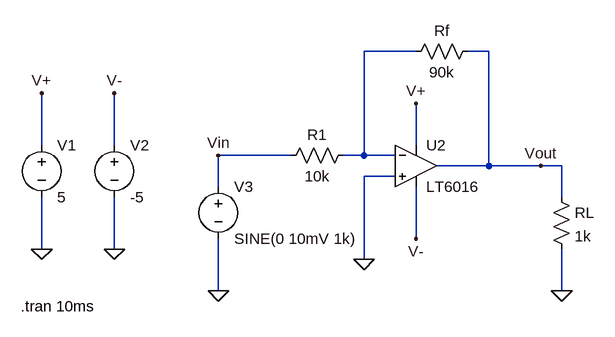
[diagram p0: schematic Lab_Task_3.asc]
Lab_Task_3.asc, the LTspice schematic file:
Version 4.1
SHEET 1 880 680
WIRE 240 0 160 0
WIRE 352 0 320 0
WIRE -336 144 -336 64
WIRE -224 144 -224 64
WIRE 240 144 240 80
WIRE 48 160 -64 160
WIRE 160 160 160 0
WIRE 160 160 128 160
WIRE 208 160 160 160
WIRE 352 176 352 0
WIRE 352 176 272 176
WIRE 432 176 352 176
WIRE 464 176 432 176
WIRE 208 192 160 192
WIRE -64 208 -64 160
WIRE 464 224 464 176
WIRE 240 288 240 208
WIRE -336 304 -336 224
WIRE -224 304 -224 224
WIRE 160 320 160 192
WIRE -64 368 -64 288
WIRE 464 368 464 304
FLAG 464 368 0
FLAG -64 368 0
FLAG -336 304 0
FLAG -224 304 0
FLAG 432 176 Vout
FLAG 160 320 0
FLAG -64 160 Vin
FLAG 240 80 V+
FLAG -336 64 V+
FLAG -224 64 V-
FLAG 240 288 V-
SYMBOL OpAmps\\LT6016 240 176 R0
SYMATTR InstName U2
SYMBOL res 448 208 R0
SYMATTR InstName RL
SYMATTR Value 1k
SYMBOL res 144 144 R90
WINDOW 0 0 56 VBottom 2
WINDOW 3 32 56 VTop 2
SYMATTR InstName R1
SYMATTR Value 10k
SYMBOL voltage -64 192 R0
SYMATTR InstName V3
SYMATTR Value SINE(0 10mV 1k)
SYMBOL res 336 -16 R90
WINDOW 0 0 56 VBottom 2
WINDOW 3 32 56 VTop 2
SYMATTR InstName Rf
SYMATTR Value 90k
SYMBOL voltage -336 128 R0
SYMATTR InstName V1
SYMATTR Value 5
SYMBOL voltage -224 128 R0
SYMATTR InstName V2
SYMATTR Value -5
TEXT -368 392 Left 2 !.tran 10ms

The netlist it stands for:
* Lab_Task_3.asc
* U2: LT6016 (symbol OpAmps\LT6016 not available, pins judged from their places): In+=0 In-=N001 V+=V+ V-=V- OUT=Vout
RL Vout 0 1k
R1 N001 Vin 10k
V3 Vin 0 SINE(0 10mV 1k)
Rf Vout N001 90k
V1 V+ 0 5
V2 V- 0 -5
.tran 10ms
.backanno
.end